# Altium schematic sheet STC89C52.SchDoc
size A3; SheetNumber: 1; SheetTotal: 1; SPICEModelCacheOEEUIIVR: <root> / <DocumentId>OEEUIIVR</DocumentId> / <CacheFrame Number="0"> / <Model Name="led0" Kind="MDL"> / <Text>*Typ INFRARED GaAs LED: Vf=1.2V Vr=5V If=40mA trr=3uS / *LED Pinout: 1=A, 2=K / .MODEL LED0 D (IS=93.5P RS=84M N=2.63 BV=5 IBV=10U / + CJO=2.97P VJ=.75 M=.333 TT=4.32U)</Text> / </Model> / </CacheFrame> / </root>
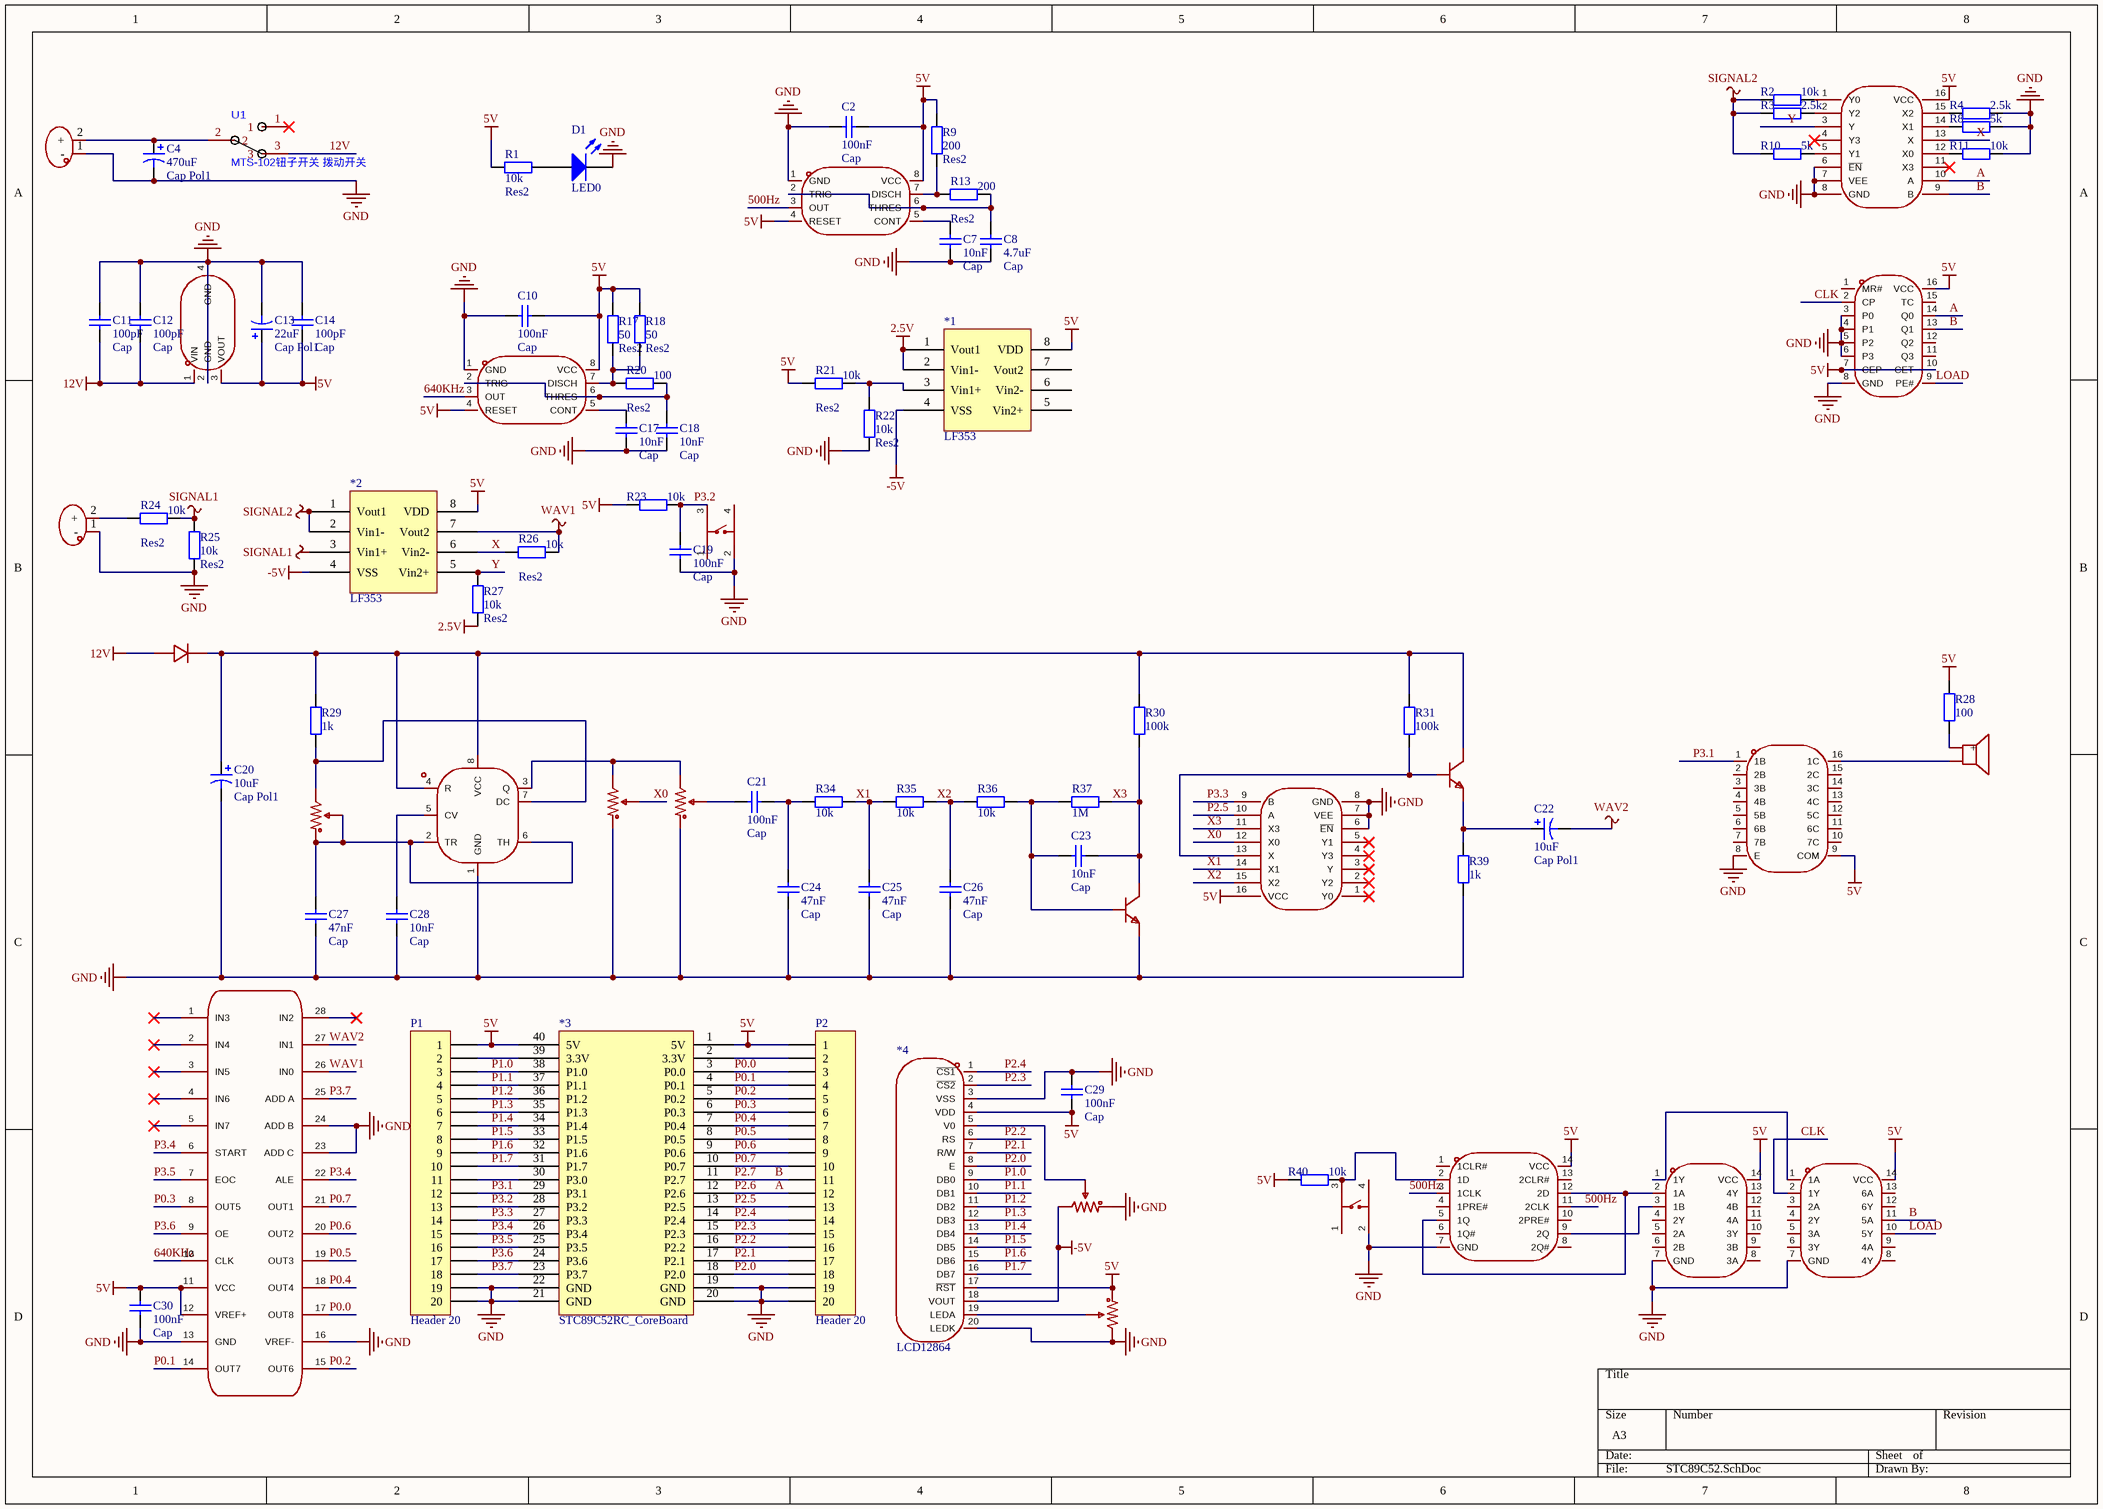
[diagram p0: STC89C52.SchDoc]

## Parts
*1  LF353  [MCP6022]
*2  LF353  [MCP6022]
*3  STC89C52RC_CoreBoard  [STC89C52RC_CoreBoard]
*4  LCD12864  [LCD12864]
BUZZER1  2.7kHz  [BEEP 5x9x5.5]  (value not drawn)
C2  Cap  value 100nF  [C0603_M]
C4  Cap Pol1  value 470uF  [CAP-SMD_BD8.0-L8.3-W8.3-FD]
C7  Cap  value 10nF  [C0603_M]
C8  Cap  value 4.7uF  [C0603_M]
C10  Cap  value 100nF  [C0603_M]
C11  Cap  value 100pF  [C0603_M]
C12  Cap  value 100pF  [C0603_M]
C13  Cap Pol1  value 22uF  [C_3528]
C14  Cap  value 100pF  [C0603_M]
C17  Cap  value 10nF  [C0603_M]
C18  Cap  value 10nF  [C0603_M]
C19  Cap  value 100nF  [C0603_M]
C20  Cap Pol1  value 10uF  [C_3528]
C21  Cap  value 100nF  [C0603_M]
C22  Cap Pol1  value 10uF  [C_3528]
C23  Cap  value 10nF  [C0603_M]
C24  Cap  value 47nF  [C0603_M]
C25  Cap  value 47nF  [C0603_M]
C26  Cap  value 47nF  [C0603_M]
C27  Cap  value 47nF  [C0603_M]
C28  Cap  value 10nF  [C0603_M]
C29  Cap  value 100nF  [C0603_M]
C30  Cap  value 100nF  [C0603_M]
D1  LED0  [LED0805_W]
D4  1N4007W_C18199088  [1N4007]  (value not drawn)
P1  Header 20  [HDR1X20]
P2  Header 20  [HDR1X20]
Q3  MMS8050-H-TP  [S8050]  (value not drawn)
Q4  MMS8050-H-TP  [S8050]  (value not drawn)
R1  Res2  value 10k  [R0603_M]
R2  value 10k  [R0603_M]  (hidden comment: Res2)
R3  value 2.5k  [R0603_M]  (hidden comment: Res2)
R4  value 2.5k  [R0603_M]  (hidden comment: Res2)
R8  value 5k  [R0603_M]  (hidden comment: Res2)
R9  Res2  value 200  [R0603_M]
R10  value 5k  [R0603_M]  (hidden comment: Res2)
R11  value 10k  [R0603_M]  (hidden comment: Res2)
R13  Res2  value 200  [R0603_M]
R17  Res2  value 50  [R0603_M]
R18  Res2  value 50  [R0603_M]
R20  Res2  value 100  [R0603_M]
R21  Res2  value 10k  [R0603_M]
R22  Res2  value 10k  [R0603_M]
R23  value 10k  [R0603_M]  (hidden comment: Res2)
R24  Res2  value 10k  [R0603_M]
R25  Res2  value 10k  [R0603_M]
R26  Res2  value 10k  [R0603_M]
R27  Res2  value 10k  [R0603_M]
R28  value 100  [R0603_M]  (hidden comment: Res2)
R29  value 1k  [R0603_M]  (hidden comment: Res2)
R30  value 100k  [R0603_M]  (hidden comment: Res2)
R31  value 100k  [R0603_M]  (hidden comment: Res2)
R32  3362P-1-203_C48997909  [RES-ADJ-TH_3362P]  (value not drawn)
R33  3362P-1-203_C48997909  [RES-ADJ-TH_3362P]  (value not drawn)
R34  value 10k  [R0603_M]  (hidden comment: Res2)
R35  value 10k  [R0603_M]  (hidden comment: Res2)
R36  value 10k  [R0603_M]  (hidden comment: Res2)
R37  value 1M  [R0603_M]  (hidden comment: Res2)
R38  3362P-1-203_C48997909  [RES-ADJ-TH_3362P]  (value not drawn)
R39  value 1k  [R0603_M]  (hidden comment: Res2)
R40  value 10k  [R0603_M]  (hidden comment: Res2)
R41  3362P-1-203_C48997909  [RES-ADJ-TH_3362P]  (value not drawn)
R42  3362P-1-203_C48997909  [RES-ADJ-TH_3362P]  (value not drawn)
SW1  KH-6X6X8H-STM  [SW-SMD_4P-L6.0-W6.0-P4.50-LS9.0-1]  (value not drawn)
SW2  KH-6X6X8H-STM  [SW-SMD_4P-L6.0-W6.0-P4.50-LS9.0-1]  (value not drawn)
U1  MTS-102钮子开关 拨动开关  [MTS102]
U2  XT30U-F  [CONN-TH_XT60]  (value not drawn)
U3  74HC4052PW,118  [74HC4052]  (value not drawn)
U5  NE555DR_C695838  [NE555]  (value not drawn)
U6  LM2940S-5.0/TR  [LM2940]  (value not drawn)
U7  SN74LS161ADR(LX)  [74LS161]  (value not drawn)
U8  NE555DR_C695838  [NE555]  (value not drawn)
U9  XT30U-F  [HDR1X2]  (value not drawn)
U10  NE555DR_C695838  [NE555]  (value not drawn)
U11  ULN2003D1013TR  [ULN2003D]  (value not drawn)
U12  74HC4052PW,118  [74HC4052]  (value not drawn)
U13  SN74LS74ADR  [74LS74]  (value not drawn)
U14  SN74HC02N  [74HC02]  (value not drawn)
U15  SN74HC04DR  [74HC04]  (value not drawn)
U16  DS1009-28AT1WX-0A2  [ADC0808]  (value not drawn)

## Nets
2.5V: *1.1(Vout1) *1.2(Vin1-) R27.2
5V: *1.8(VDD) *2.8(VDD) *3.1(5V) *3.40(5V) *4.4(VDD) *4.17(~{RST}) C2.2 C10.2 C13.1 C14.1 C29.1 C30.2 P1.1 P2.1 R1.2 R9.2 R17.2 R18.2 R21.1 R23.1 R28.1 R40.1 R41.1 U3.16(VCC) U5.4(RESET) U5.8(VCC) U6.3(VOUT) U7.7(CEP) U7.10(CET) U7.16(VCC) U8.4(RESET) U8.8(VCC) U11.9(COM) U12.16(VCC) U13.14(VCC) U14.14(VCC) U15.14(VCC) U16.11(VCC) U16.12(VREF+)
12V: C11.1 C12.1 D4.2(A) U1.3 U6.1(VIN)
-5V: *1.4(VSS) *2.4(VSS) *4.18(VOUT) R42.3
GND: *3.19(GND) *3.20(GND) *3.21(GND) *3.22(GND) *4.3(VSS) *4.20(LEDK) C2.1 C4.2 C7.1 C8.2 C10.1 C11.2 C12.2 C13.2 C14.2 C17.1 C18.2 C19.2 C20.2 C24.2 C25.2 C26.2 C27.2 C28.2 C29.2 C30.1 D1.2(K) P1.19 P1.20 P2.19 P2.20 Q4.2(E) R4.2 R8.2 R11.2 R22.2 R25.2 R32.1 R33.1 R39.2 R41.3 R42.1 SW1.2(C) SW2.2(C) U2.1(-) U3.6(~{EN}) U3.7(VEE) U3.8(GND) U5.1(GND) U6.2(GND) U6.4(GND) U7.3(P0) U7.4(P1) U7.5(P2) U7.6(P3) U7.8(GND) U8.1(GND) U9.1(-) U10.1(GND) U11.8(E) U12.6(~{EN}) U12.7(VEE) U12.8(GND) U13.7(GND) U14.7(GND) U15.7(GND) U16.13(GND) U16.16(VREF-) U16.23(ADD_C) U16.24(ADD_B)
SIGNAL1: *2.3(Vin1+) R24.2 R25.1
SIGNAL2: *2.1(Vout1) *2.2(Vin1-) R2.1 R3.1 R10.1
WAV1: *2.7(Vout2) R26.2 U16.26(IN0)
WAV2: C22.2 U16.27(IN1)
500Hz: U5.3(OUT) U13.3(1CLK) U13.11(2CLK)
640KHz: U8.3(OUT) U16.10(CLK)
A: *3.12(P2.6) P2.12 U3.10(A) U7.14(Q0)  [also labelled P2.6]
B: *3.11(P2.7) P2.11 U3.9(B) U7.13(Q1) U15.11(5A)  [also labelled P2.7]
CLK: U7.2(CP) U15.2(1Y)
LOAD: U7.9(PE#) U15.10(5Y)
P0.0: *3.3(P0.0) P2.3 U16.17(OUT8)
P0.1: *3.4(P0.1) P2.4 U16.14(OUT7)
P0.2: *3.5(P0.2) P2.5 U16.15(OUT6)
P0.3: *3.6(P0.3) P2.6 U16.8(OUT5)
P0.4: *3.7(P0.4) P2.7 U16.18(OUT4)
P0.5: *3.8(P0.5) P2.8 U16.19(OUT3)
P0.6: *3.9(P0.6) P2.9 U16.20(OUT2)
P0.7: *3.10(P0.7) P2.10 U16.21(OUT1)
P1.0: *3.38(P1.0) *4.9(DB0) P1.3
P1.1: *3.37(P1.1) *4.10(DB1) P1.4
P1.2: *3.36(P1.2) *4.11(DB2) P1.5
P1.3: *3.35(P1.3) *4.12(DB3) P1.6
P1.4: *3.34(P1.4) *4.13(DB4) P1.7
P1.5: *3.33(P1.5) *4.14(DB5) P1.8
P1.6: *3.32(P1.6) *4.15(DB6) P1.9
P1.7: *3.31(P1.7) *4.16(DB7) P1.10
P2.0: *3.18(P2.0) *4.8(E) P2.18
P2.1: *3.17(P2.1) *4.7(R/W) P2.17
P2.2: *3.16(P2.2) *4.6(RS) P2.16
P2.3: *3.15(P2.3) *4.2(~{CS2}) P2.15
P2.4: *3.14(P2.4) *4.1(~{CS1}) P2.14
P2.5: *3.13(P2.5) P2.13 U12.10(A)
P3.1: *3.29(P3.1) P1.12 U11.1(1B)
P3.2: *3.28(P3.2) C19.1 P1.13 R23.2 SW1.3(B)
P3.3: *3.27(P3.3) P1.14 U12.9(B)
P3.4: *3.26(P3.4) P1.15 U16.6(START) U16.22(ALE)
P3.5: *3.25(P3.5) P1.16 U16.7(EOC)
P3.6: *3.24(P3.6) P1.17 U16.9(OE)
P3.7: *3.23(P3.7) P1.18 U16.25(ADD_A)
X: *2.6(Vin2-) R26.1 U3.13(X)
X0: R32.2 U12.12(X0)
X1: C25.1 R34.1 R35.2 U12.14(X1)
X2: C26.1 R35.1 R36.2 U12.15(X2)
X3: C23.2 Q4.3(C) R30.2 R37.1 U12.11(X3)
Y: *2.5(Vin2+) R27.1 U3.3(Y)
Net*1_3: *1.3(Vin1+) R21.2 R22.1
Net*3_2: *3.2(3.3V) P2.2
Net*3_30: *3.30(P3.0) P1.11
Net*3_39: *3.39(3.3V) P1.2
Net*4_5: *4.5(V0) R42.2
Net*4_19: *4.19(LEDA) R41.2
NetBUZZER1_1: BUZZER1.1(+) R28.2
NetBUZZER1_2: BUZZER1.2 U11.16(1C)
NetC4_1: C4.1 U1.2 U2.2(+)
NetC7_2: C7.2 U5.5(CONT)
NetC8_1: C8.1 R13.2 U5.2(TRIG) U5.6(THRES)
NetC17_2: C17.2 U8.5(CONT)
NetC18_1: C18.1 R20.2 U8.2(TRIG) U8.6(THRES)
NetC20_1: C20.1 D4.1(K) Q3.3(C) R29.2 R30.1 R31.1 U10.4(R) U10.8(VCC)
NetC21_1: C21.1 C24.1 R34.2
NetC21_2: C21.2 R33.2
NetC22_1: C22.1 Q3.2(E) R39.1
NetC23_1: C23.1 Q4.1(B) R36.1 R37.2
NetC27_1: C27.1 R38.1 R38.2 U10.2(TR) U10.6(TH)
NetC28_1: C28.1 U10.5(CV)
NetD1_1: D1.1(A) R1.1
NetQ3_1: Q3.1(B) R31.2 U12.13(X)
NetR2_2: R2.2 U3.1(Y0)
NetR3_2: R3.2 U3.2(Y2)
NetR4_1: R4.1 U3.15(X2)
NetR8_1: R8.1 U3.14(X1)
NetR9_1: R9.1 R13.1 U5.7(DISCH)
NetR10_2: R10.2 U3.5(Y1)
NetR11_1: R11.1 U3.12(X0)
NetR17_1: R17.1 R18.1 R20.1 U8.7(DISCH)
NetR24_1: R24.1 U9.2(+)
NetR29_1: R29.1 R38.3 U10.7(DC)
NetR32_3: R32.3 R33.3 U10.3(Q)
NetR40_2: R40.2 SW2.3(B) U13.2(1D)
NetU13_5: U13.5(1Q) U13.12(2D) U14.2(1A)
NetU13_9: U13.9(2Q) U14.3(1B)
NetU14_1: U14.1(1Y) U15.1(1A)

Not connected (* = marked no-connect by the designer): *1 5(Vin2+) 6(Vin2-) 7(Vout2); SW1 1(A) 4(D); SW2 1(A) 4(D); U1 1*; U3 4(Y3)* 11(X3)*; U7 1(MR#) 11(Q3) 12(Q2) 15(TC); U11 2(2B) 3(3B) 4(4B) 5(5B) 6(6B) 7(7B) 10(7C) 11(6C) 12(5C) 13(4C) 14(3C) 15(2C); U12 1(Y0)* 2(Y2)* 3(Y)* 4(Y3)* 5(Y1)*; U13 1(1CLR#) 4(1PRE#) 6(1Q#) 8(2Q#) 10(2PRE#) 13(2CLR#); U14 4(2Y) 5(2A) 6(2B) 8(3A) 9(3B) 10(3Y) 11(4A) 12(4B) 13(4Y); U15 3(2A) 4(2Y) 5(3A) 6(3Y) 8(4Y) 9(4A) 12(6Y) 13(6A); U16 1(IN3)* 2(IN4)* 3(IN5)* 4(IN6)* 5(IN7)* 28(IN2)*

## Library data of the parts
*1 *2 = MCP6022
BUZZER1 = 蜂鸣器: Manufacturer: 华能; Symbol: TMB12A05; Device: TMB12A05_C96093; Add into BOM: yes; Oscillator Circuit: 有源(内含驱动线路); Technology Type: 电磁式; Operating Voltage: 4V~8V; Sound Pressure Level (SPL): 85dB; LCSC Part Name: TMB12A05; Supplier Part: C96093; Manufacturer Part: TMB12A05; Supplier Footprint: 插件,D=12mm; JLCPCB Part Class: Extended Part; Datasheet: https://atta.szlcsc.com/upload/public/pdf/source/20230426/A4FC10532558AA232D532AB83455FBA4.pdf; Supplier: LCSC; Convert to PCB: yes; Value: 2.7kHz; Current Consumption: -; Diameter (φD): 12mm; Length: -; Width: -; Height: 9.8mm; Operating Temperature: -
C2 C7 C8 C10-C12 C14 C17-C19 C21 C23-C30 = Cap: Capacitor; Published: 8-Jun-2000; LatestRevisionDate: 17-Jul-2002; LatestRevisionNote: Re-released for DXP Platform.; PackageReference: RAD-0.3; Publisher: Altium Limited; PackageDescription: Radial Cap, Thru-Hole; 2 Leads; 0.3 in Pin Spacing
C4 C13 C20 C22 = Cap Pol1: Polarized Capacitor (Radial); Published: 8-Jun-2000; LatestRevisionDate: 17-Jul-2002; LatestRevisionNote: Re-released for DXP Platform.; PackageReference: RB7.6-15; Publisher: Altium Limited; PackageDescription: Polarized Capacitor (Radial); 2 Leads
D1 = LED0: Typical INFRARED GaAs LED; Published: 8-Jun-2000; LatestRevisionDate: 08-Jul-2005; LatestRevisionNote: Mech Layer 1 removed.; PackageReference: LED-0; Publisher: Altium Limited; PackageDescription: LED; 2 Leads
P1 P2 = Header 20: Header, 20-Pin; LatestRevisionDate: 17-Jul-2002; LatestRevisionNote: Re-released for DXP Platform.; Publisher: Altium Limited
R1-R4 R8-R11 R13 R17 R18 R20-R31 R34-R37 R39 R40 = Res2: Resistor; Published: 8-Jun-2000; LatestRevisionDate: 17-Jul-2002; LatestRevisionNote: Re-released for DXP Platform.; PackageReference: AXIAL-0.4; Publisher: Altium Limited; PackageDescription: Axial Device, Thru-Hole; 2 Leads; 0.4 in Pin Spacing
U2 U9 = XT30U-F: Manufacturer: AMASS(艾迈斯); Add into BOM: yes; Brand: 艾迈斯; InterfaceType: 母头; Symbol: XT30U-F; Device: XT30U-F; LCSC Part Name: AMASS(艾迈斯)轻量版锂电池插头母头 XT30U-F; Supplier Part: C99102; Manufacturer Part: XT30U-F; Supplier Footprint: -; JLCPCB Part Class: Extended Part; Datasheet: https://atta.szlcsc.com/upload/public/pdf/source/20190916/C428721_B0ECB8C5937139CEFE8736D2D3175B0E.pdf; Supplier: LCSC; Convert to PCB: yes; Model: XT30U-F; Power: -; Output: -; Input: -; Size: -; Interface: -; Type: 插头; Colour: 黄色; MaximumCurrent: -; RatedVoltage: -; Type1: -; NumberOfUSBHoles: -; MetalMaterial: -; InsulationMaterial: -; RatedCurrent: -; RecommendedWireGauge: -; FlameRetardantGrade: -; contact resistance: -; Belt length: -; specifications: -
U10 = NE555: Symbol: NE555DR_C695838
U11 = ULN2003D1013TR_1: Symbol: ULN2003D1013TR
U16 = ADC0808: Symbol: DS1009-28AT1WX-0A2
D4 = 1N4007W_C18199088: Symbol: 1N4007W_C18199088
Q3 Q4 = MMS8050-H-TP: Symbol: MMS8050-H-TP
R32 R33 R38 R41 R42 = 3362P-1-203_C48997909: Symbol: 3362P-1-203_C48997909
SW1 SW2 = KH-6X6X8H-STM: Symbol: KH-6X6X8H-STM
U3 U12 = 74HC4052PW,118: Symbol: 74HC4052PW,118
U5 U8 = NE555DR_C695838: Symbol: NE555DR_C695838
U6 = LM2940S-5.0/TR: Symbol: LM2940S-5.0/TR
U7 = SN74LS161ADR(LX): Symbol: SN74LS161ADR(LX)
U13 = SN74LS74ADR: Symbol: SN74LS74ADR
U14 = SN74HC02N: Symbol: SN74HC02N
U15 = SN74HC04DR: Symbol: SN74HC04DR